# EasyEDA Pro project 4片ADS1299级联.epro, schematic Schematic1

## Sheets
1 P1: Board Name: Board1; Create Date: 2024-07-01; Page Name: P1; Project Name: 【开源】ADS1299-8通道脑机接口设备; Schematic Name: Schematic1; Update Date: 2024-11-04; BladeWidth: 10; Company: 嘉立创EDA; Page Size: A4; RegionStart: 1; ShowBorder: 1; TitleBlock: 1; TitleBlockPosition: 3; Version: V1.0; XRegionCount: 6; YRegionCount: 4
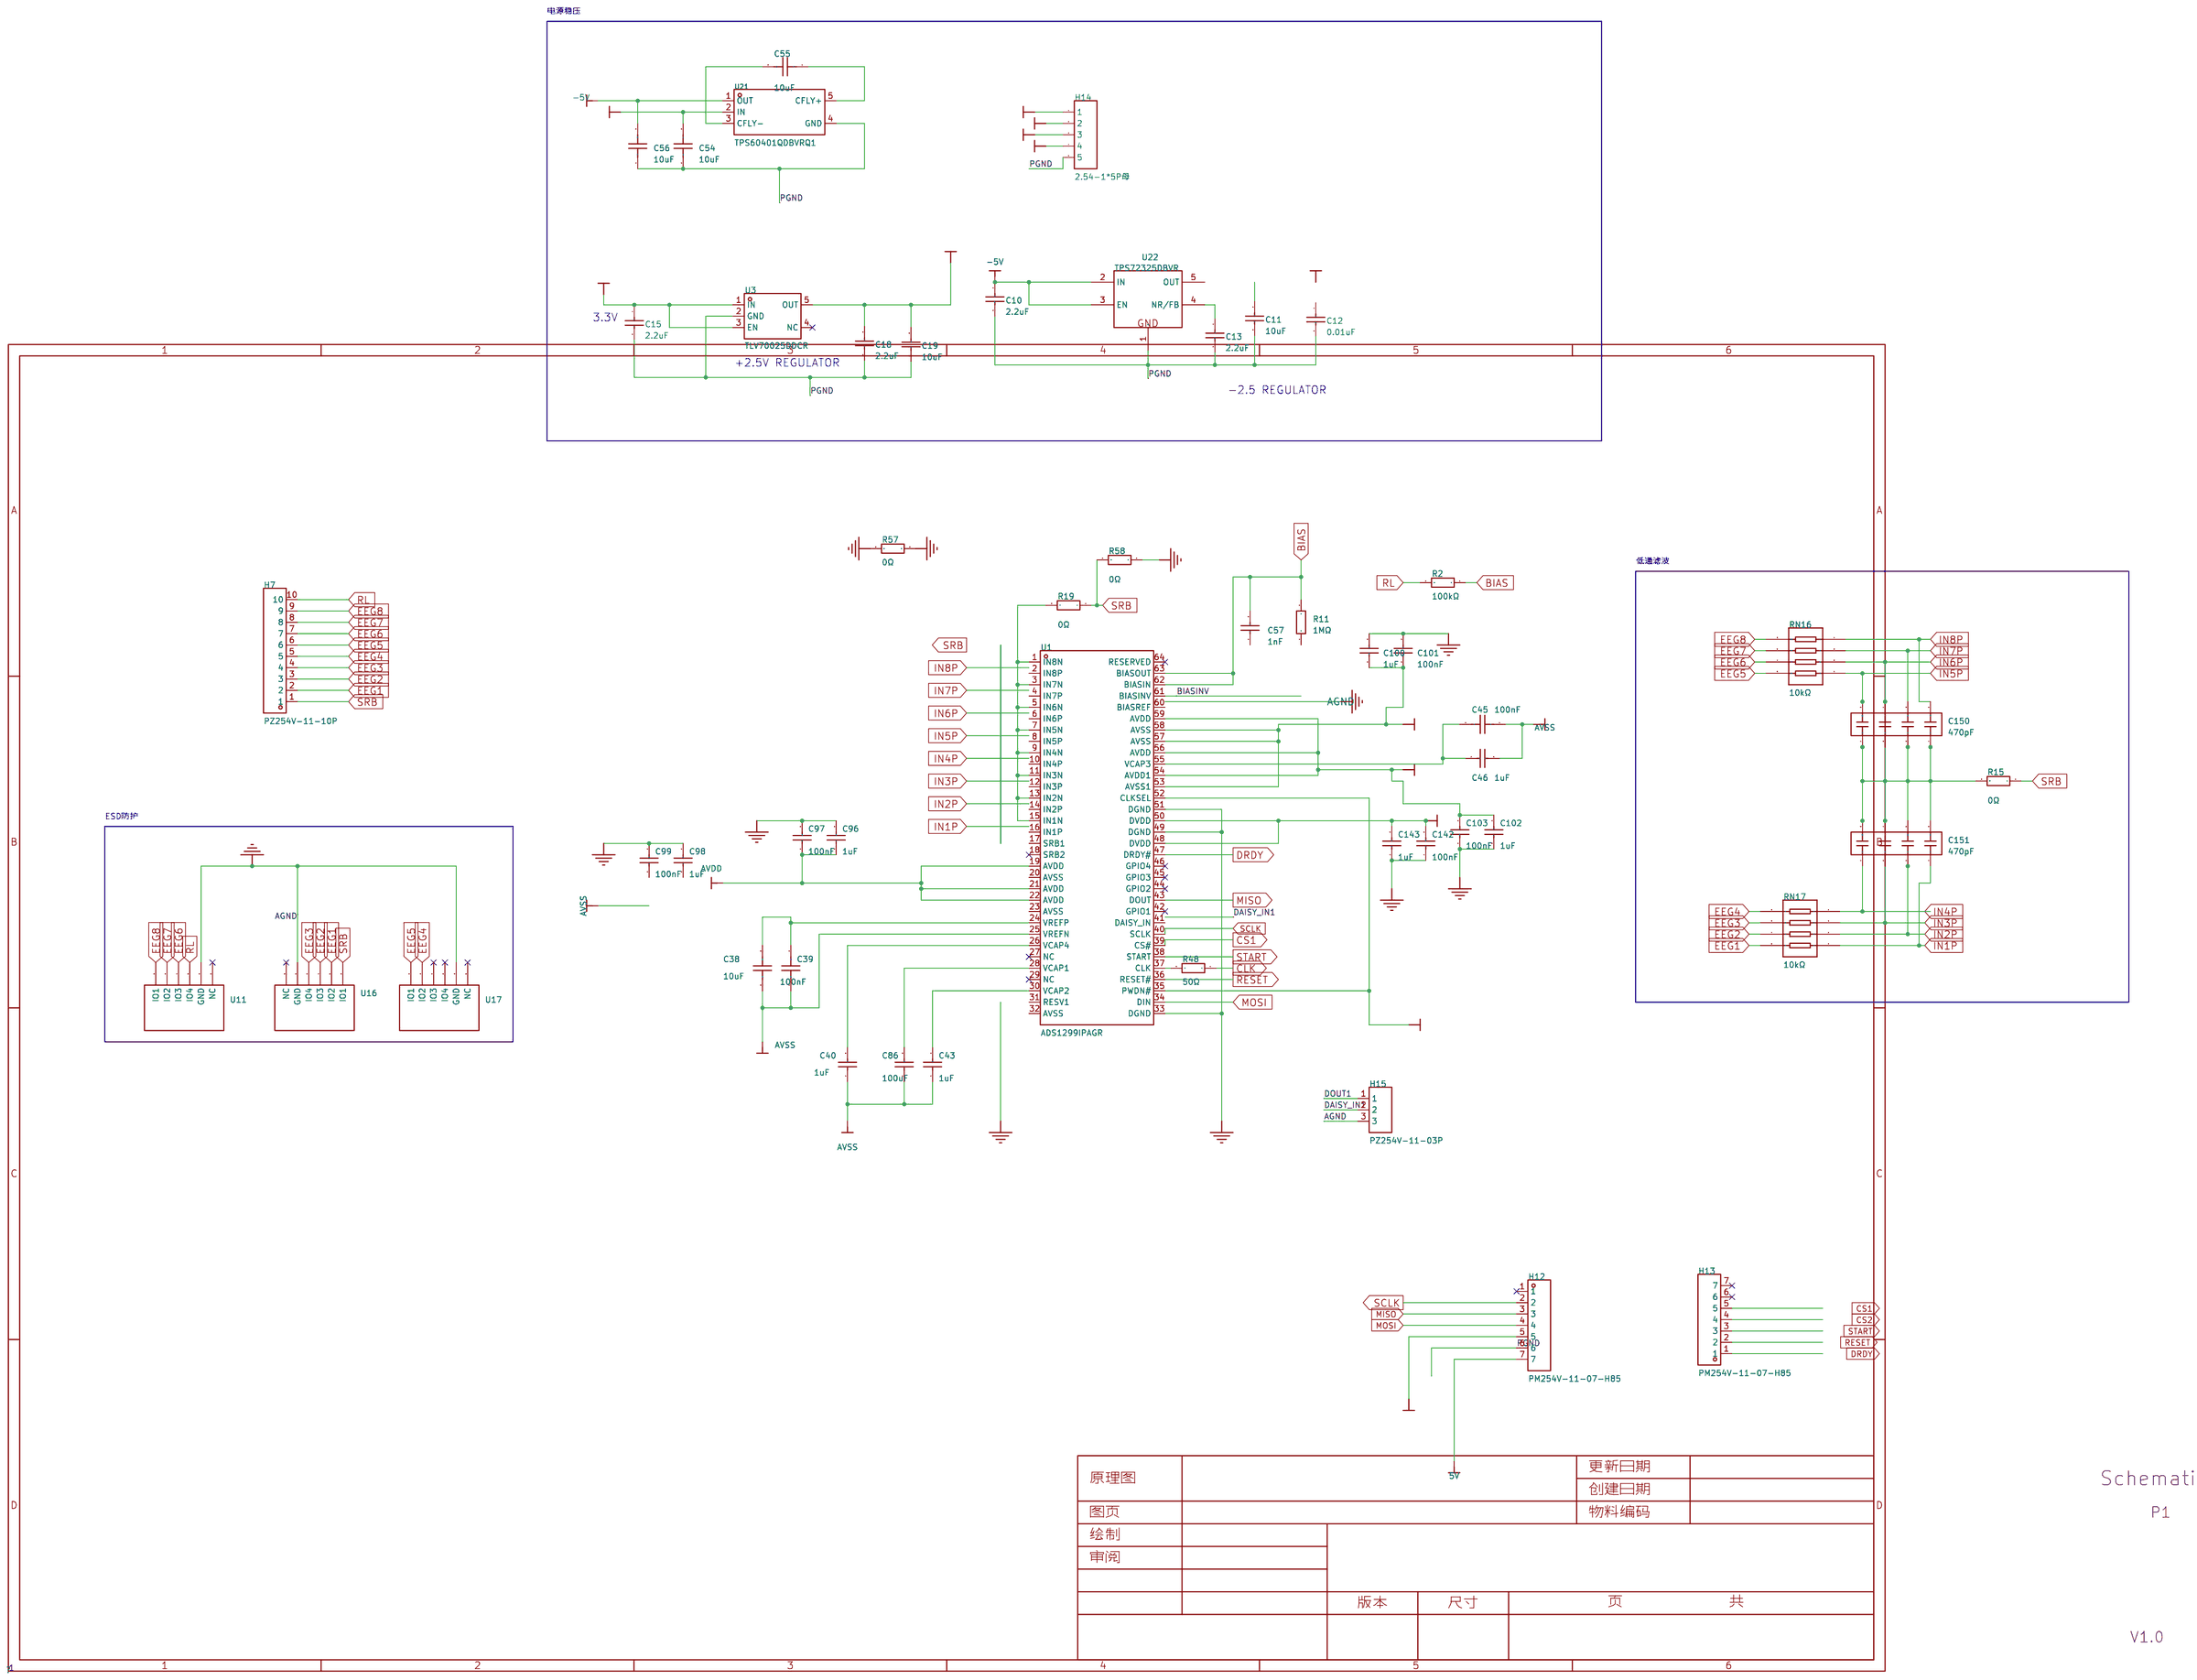
[diagram p0: P1]
2 P2: Create Date: 2026-03-20; Page Name: P3; Project Name: 【开源】ADS1299-8通道脑机接口设备_copy; Update Date: 2026-03-20
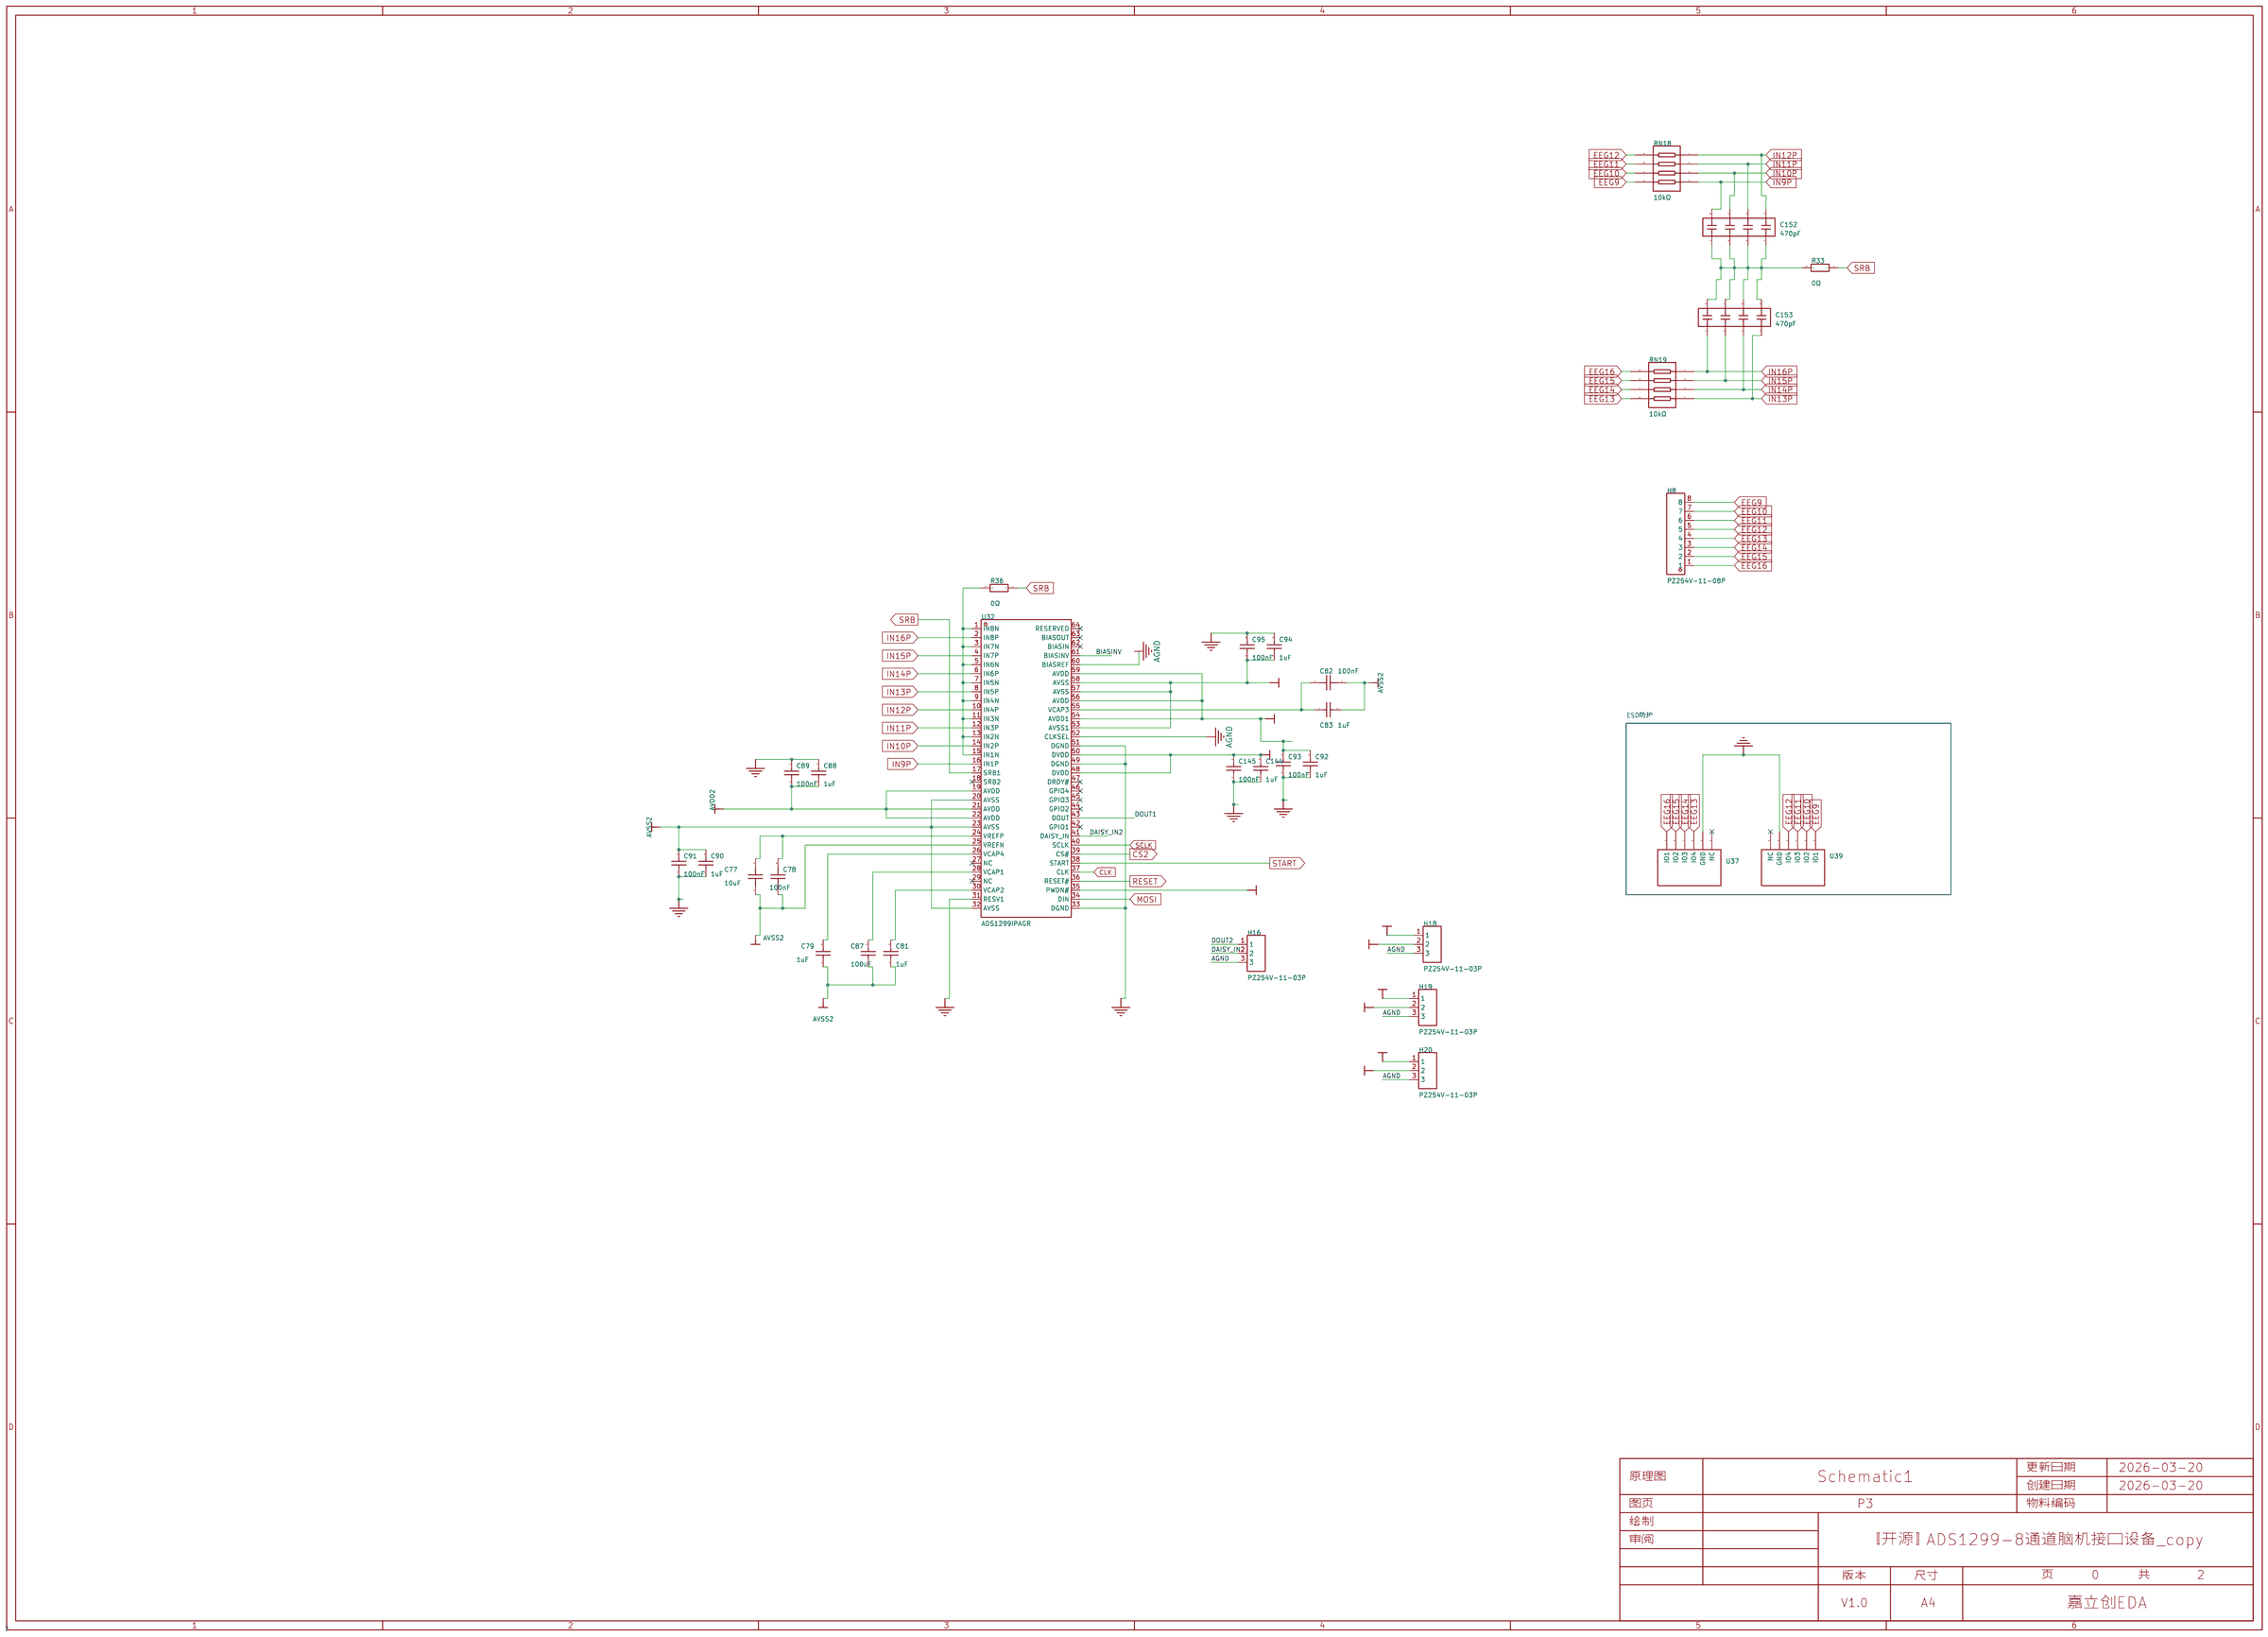
[diagram p1: P2]
3 P3: Create Date: 2026-03-25; Page Name: P3; Project Name: 16通道体表电位图仪_copy; Update Date: 2026-03-25
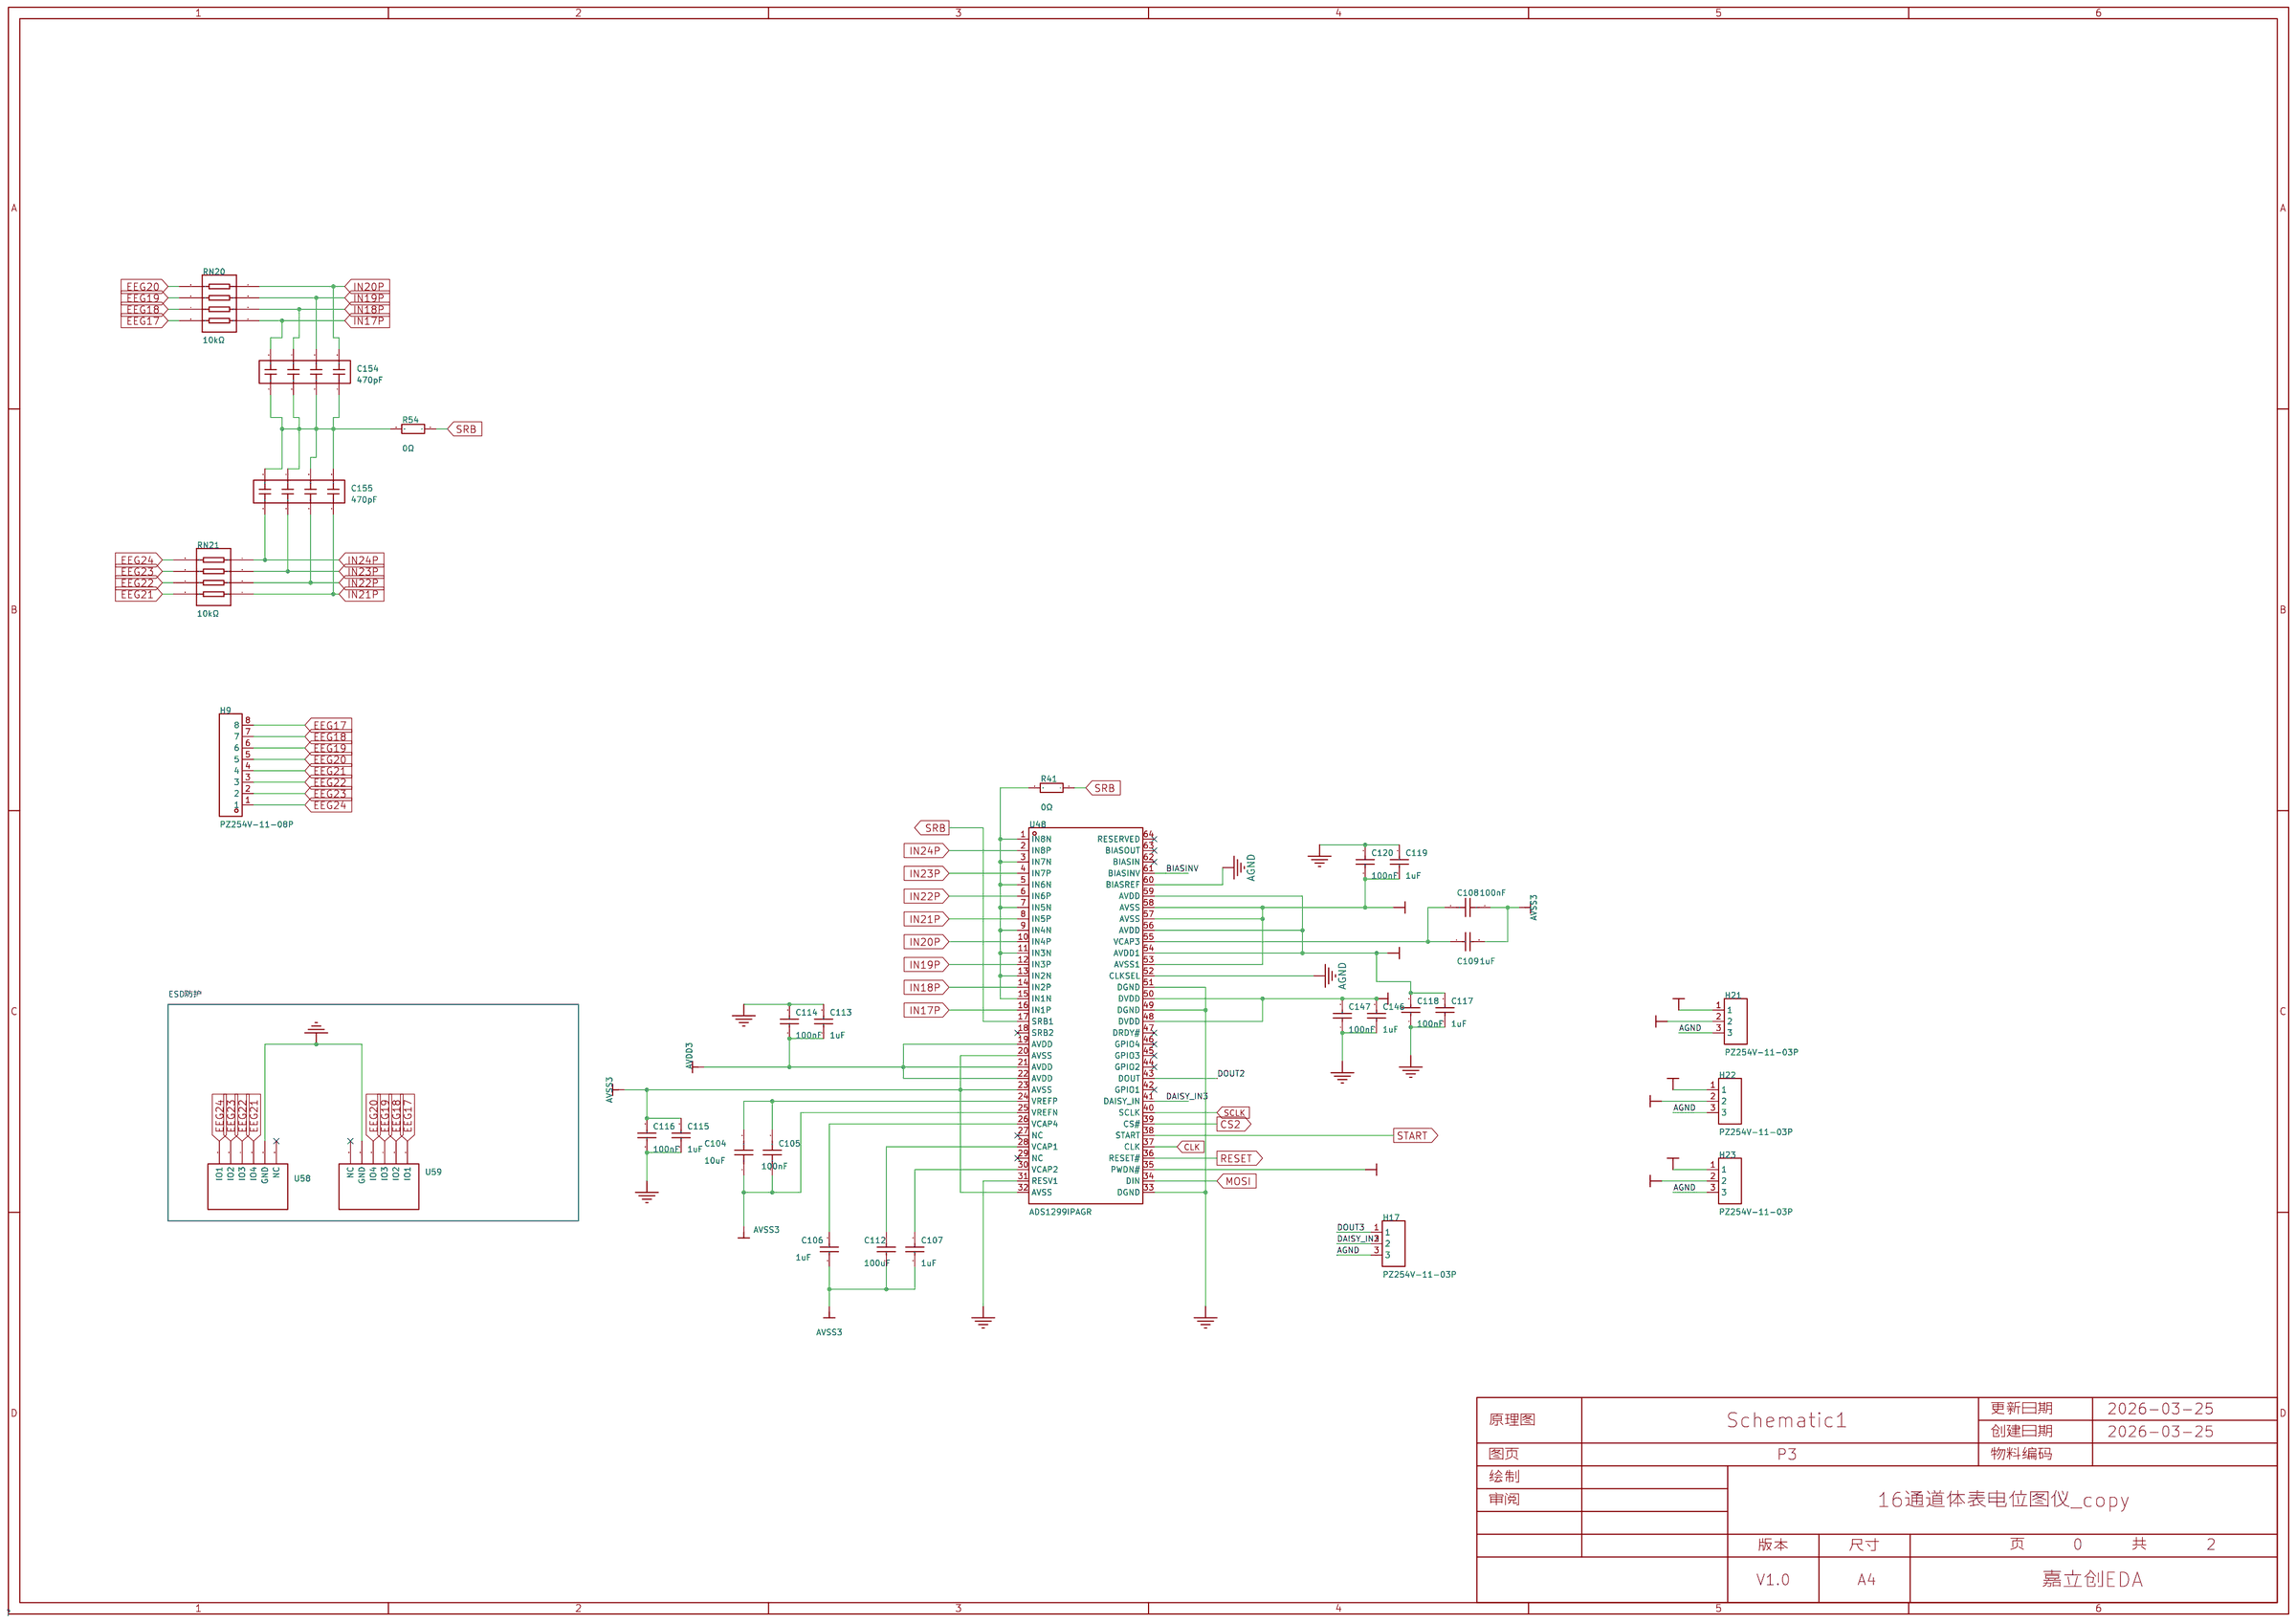
[diagram p2: P3]
4 P4: Create Date: 2026-04-07; Page Name: P4; Project Name: 16通道体表电位图仪_copy; Update Date: 2026-04-07
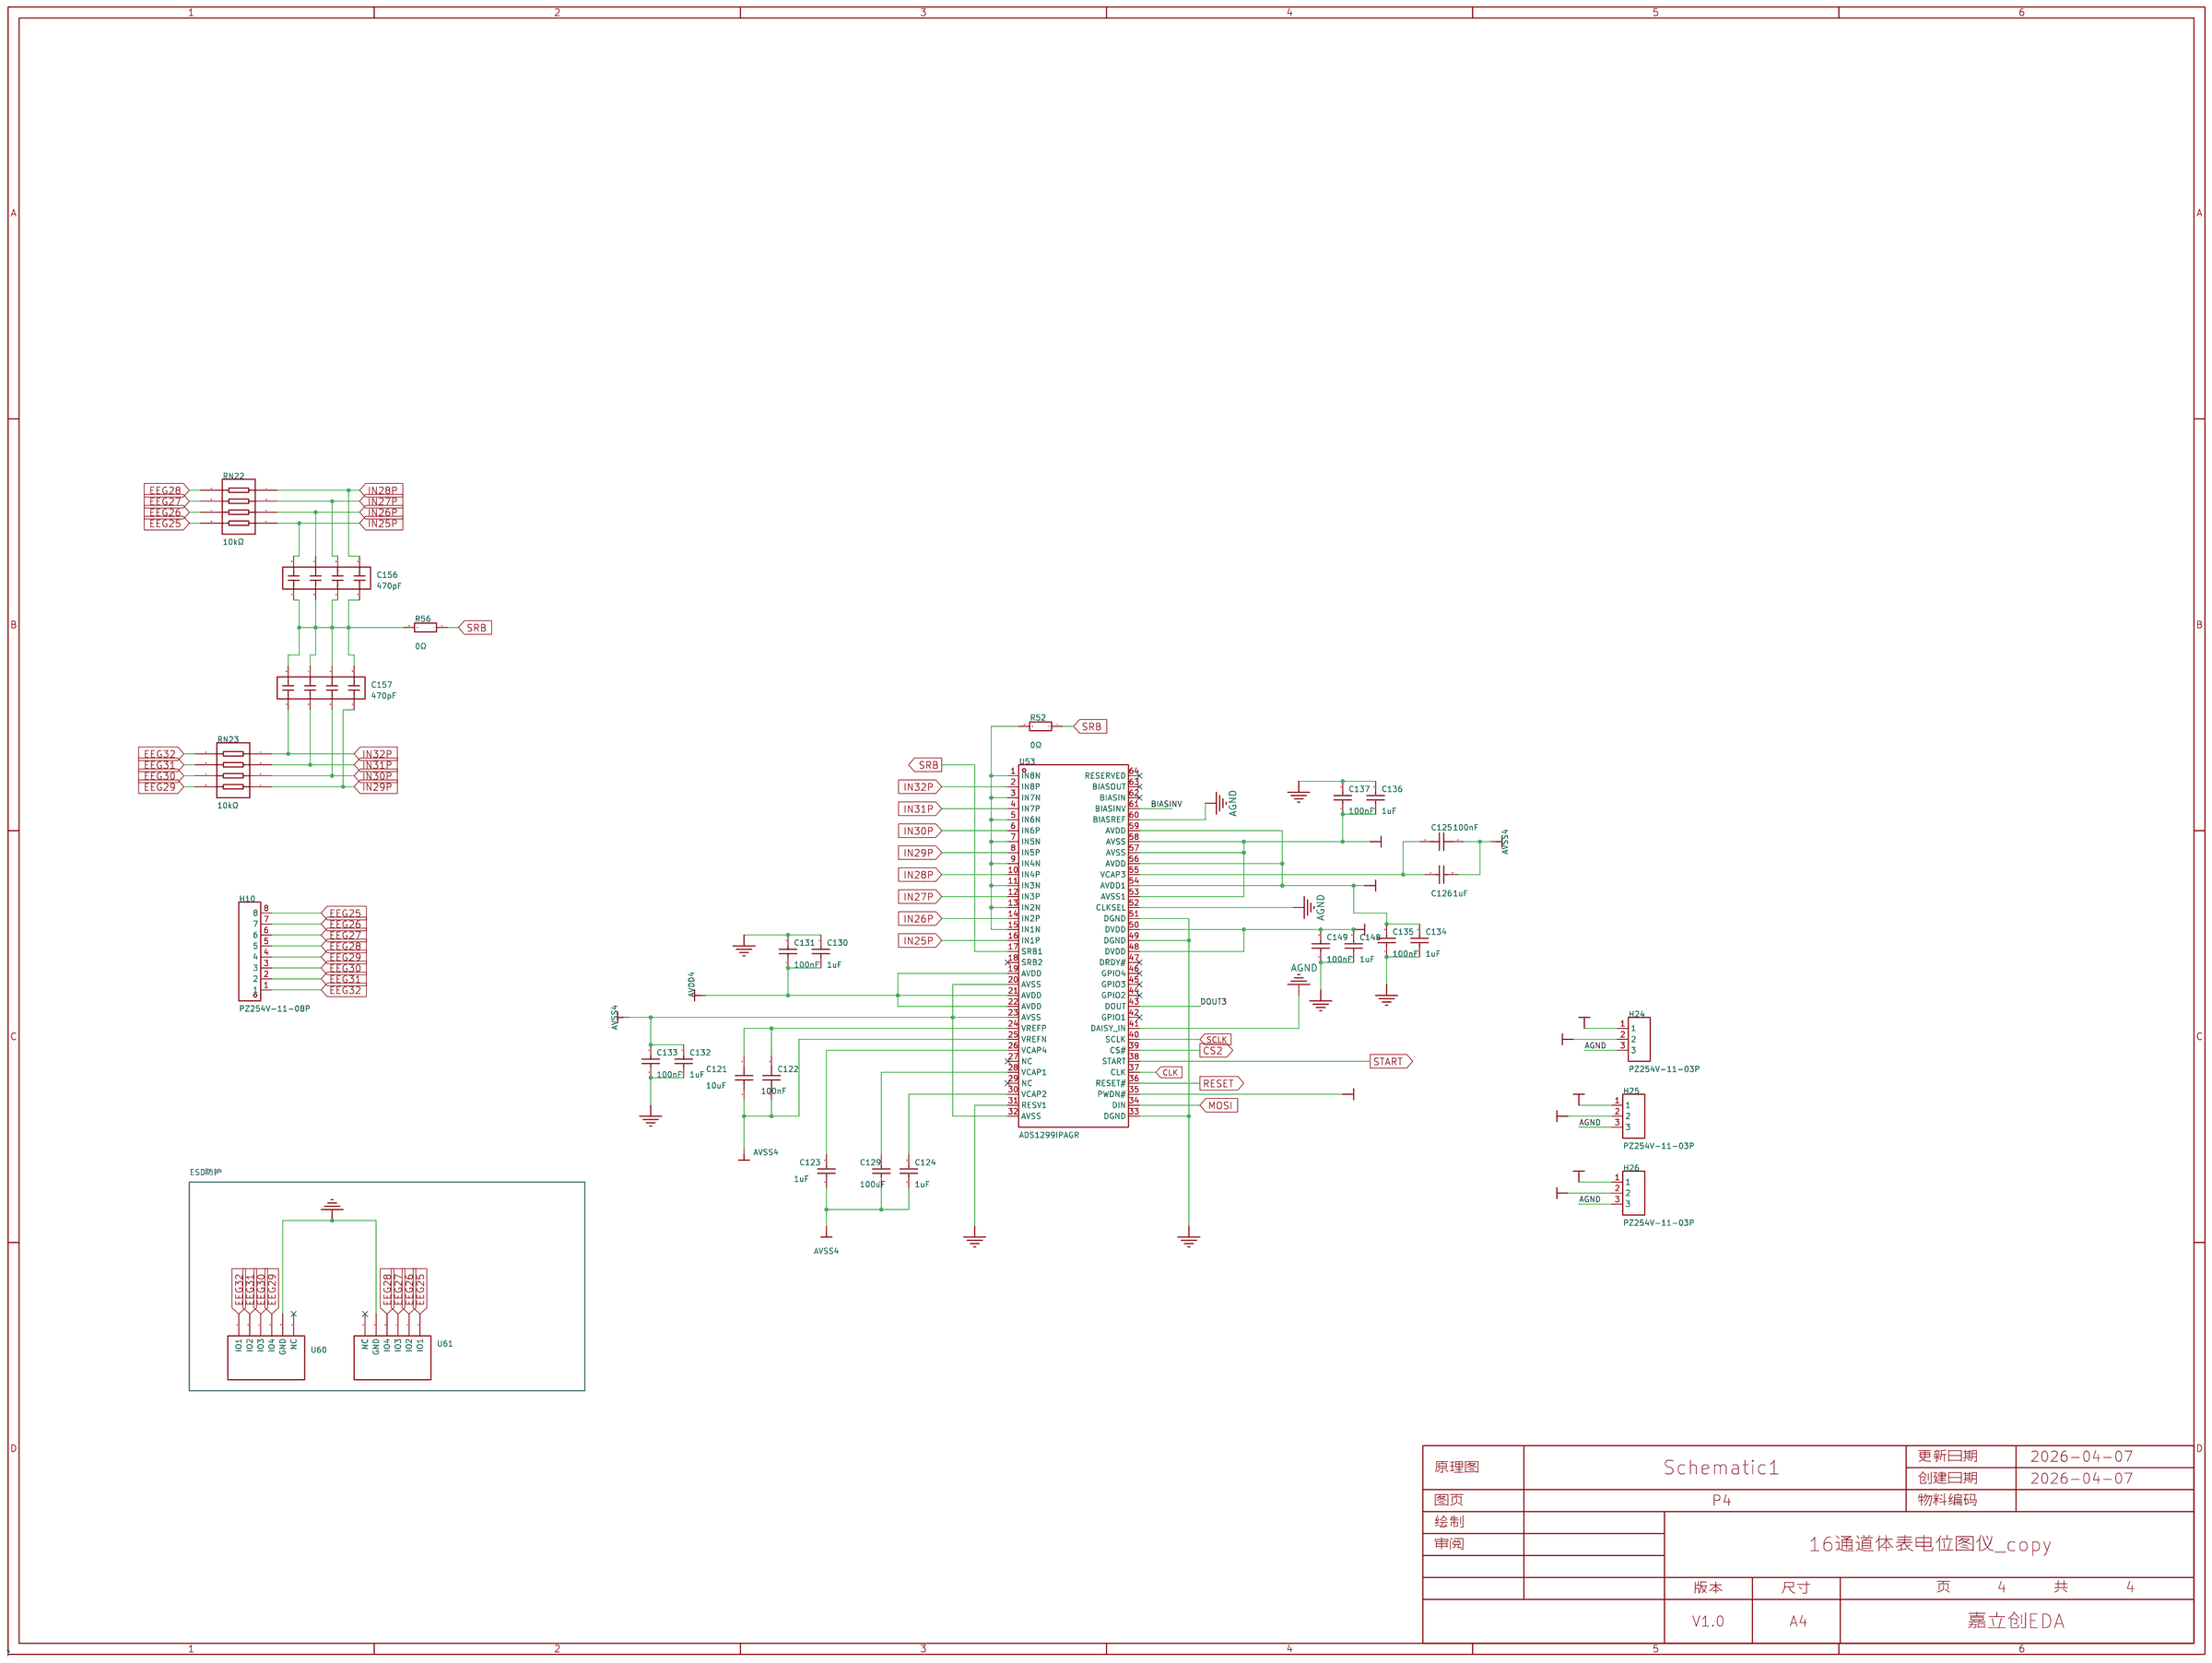
[diagram p3: P4]

## Parts
sheet P1
C10  2.2uF  [C0603]
C11  10uF  [C0603]
C12  0.01uF  [C0603]
C13  2.2uF  [C0603]
C15  2.2uF  [C0603]
C18  2.2uF  [C0603]
C19  10uF  [C0603]
C38  10uF  [C0603]
C39  100nF  [C0603]
C40  1uF  [C0603]
C43  1uF  [C0603]
C45  100nF  [C0603]
C46  1uF  [C0603]
C54  10uF  [C0603]
C55  10uF  [C0603]
C56  10uF  [C0603]
C57  1nF  [C0603]
C86  100uF  [C0603]
C96  1uF  [C0603]
C97  100nF  [C0603]
C98  1uF  [C0603]
C99  100nF  [C0603]
C100  1uF  [C0603]
C101  100nF  [C0603]
C102  1uF  [C0603]
C103  100nF  [C0603]
C142  100nF  [C0603]
C143  1uF  [C0603]
C150  470pF  [CAP-ARRAY-SMD_0612-8P-L3.2-W1.6-BL]
C151  470pF  [CAP-ARRAY-SMD_0612-8P-L3.2-W1.6-BL]
H7  PZ254V-11-10P  [HDR-TH_10P-P2.54-V-M]
H12  PM254V-11-07-H85  [HDR-TH_7P-P2.54-V-F]
H13  PM254V-11-07-H85  [HDR-TH_7P-P2.54-V-F]
H14  2.54-1*5P母  [HDR-TH_5P-P2.54-V-F]
H15  PZ254V-11-03P  [HDR-TH_3P-P2.54-V-M_PZ254V-11-03P]
R2  100kΩ  [C0603]
R11  1MΩ  [R0805]
R15  0Ω  [C0603]
R19  0Ω  [C0603]
R48  50Ω  [R0805]
R57  0Ω  [C0603]
R58  0Ω  [C0603]
RN16  10kΩ  [RES-ARRAY-SMD_0603-8P-L3.2-W1.6-BL]
RN17  10kΩ  [RES-ARRAY-SMD_0603-8P-L3.2-W1.6-BL]
U1  ADS1299IPAGR  [TQFP-64_L10.0-W10.0-P0.50-LS12.0-TL]
U3  TLV70025DDCR  [SOT-23-5_L3.0-W1.7-P0.95-LS2.8-BR]
U11  TPD4E1B06DCKR  [SC-70-6_L2.2-W1.3-P0.65-LS2.1-BL]
U16  TPD4E1B06DCKR  [SC-70-6_L2.2-W1.3-P0.65-LS2.1-BL]
U17  TPD4E1B06DCKR  [SC-70-6_L2.2-W1.3-P0.65-LS2.1-BL]
U21  TPS60401QDBVRQ1  [SOT-23-5_L2.9-W1.6-P0.95-LS2.8-BR]
U22  TPS72325DBVR  [SOT-23-5_L3.0-W1.7-P0.95-LS2.8-BR]
sheet P2
C77  10uF  [C0603]
C78  100nF  [C0603]
C79  1uF  [C0603]
C81  1uF  [C0603]
C82  100nF  [C0603]
C83  1uF  [C0603]
C87  100uF  [C0603]
C88  1uF  [C0603]
C89  100nF  [C0603]
C90  1uF  [C0603]
C91  100nF  [C0603]
C92  1uF  [C0603]
C93  100nF  [C0603]
C94  1uF  [C0603]
C95  100nF  [C0603]
C144  1uF  [C0603]
C145  100nF  [C0603]
C152  470pF  [CAP-ARRAY-SMD_0612-8P-L3.2-W1.6-BL]
C153  470pF  [CAP-ARRAY-SMD_0612-8P-L3.2-W1.6-BL]
H8  PZ254V-11-08P  [HDR-TH_8P-P2.54-V-M]
H16  PZ254V-11-03P  [HDR-TH_3P-P2.54-V-M_PZ254V-11-03P]
H18  PZ254V-11-03P  [HDR-TH_3P-P2.54-V-M_PZ254V-11-03P]
H19  PZ254V-11-03P  [HDR-TH_3P-P2.54-V-M_PZ254V-11-03P]
H20  PZ254V-11-03P  [HDR-TH_3P-P2.54-V-M_PZ254V-11-03P]
R33  0Ω  [C0603]
R36  0Ω  [C0603]
RN18  10kΩ  [RES-ARRAY-SMD_0603-8P-L3.2-W1.6-BL]
RN19  10kΩ  [RES-ARRAY-SMD_0603-8P-L3.2-W1.6-BL]
U32  ADS1299IPAGR  [TQFP-64_L10.0-W10.0-P0.50-LS12.0-TL]
U37  TPD4E1B06DCKR  [SC-70-6_L2.2-W1.3-P0.65-LS2.1-BL]
U39  TPD4E1B06DCKR  [SC-70-6_L2.2-W1.3-P0.65-LS2.1-BL]
sheet P3
C104  10uF  [C0603]
C105  100nF  [C0603]
C106  1uF  [C0603]
C107  1uF  [C0603]
C108  100nF  [C0603]
C109  1uF  [C0603]
C112  100uF  [C0603]
C113  1uF  [C0603]
C114  100nF  [C0603]
C115  1uF  [C0603]
C116  100nF  [C0603]
C117  1uF  [C0603]
C118  100nF  [C0603]
C119  1uF  [C0603]
C120  100nF  [C0603]
C146  1uF  [C0603]
C147  100nF  [C0603]
C154  470pF  [CAP-ARRAY-SMD_0612-8P-L3.2-W1.6-BL]
C155  470pF  [CAP-ARRAY-SMD_0612-8P-L3.2-W1.6-BL]
H9  PZ254V-11-08P  [HDR-TH_8P-P2.54-V-M]
H17  PZ254V-11-03P  [HDR-TH_3P-P2.54-V-M_PZ254V-11-03P]
H21  PZ254V-11-03P  [HDR-TH_3P-P2.54-V-M_PZ254V-11-03P]
H22  PZ254V-11-03P  [HDR-TH_3P-P2.54-V-M_PZ254V-11-03P]
H23  PZ254V-11-03P  [HDR-TH_3P-P2.54-V-M_PZ254V-11-03P]
R41  0Ω  [C0603]
R54  0Ω  [C0603]
RN20  10kΩ  [RES-ARRAY-SMD_0603-8P-L3.2-W1.6-BL]
RN21  10kΩ  [RES-ARRAY-SMD_0603-8P-L3.2-W1.6-BL]
U48  ADS1299IPAGR  [TQFP-64_L10.0-W10.0-P0.50-LS12.0-TL]
U58  TPD4E1B06DCKR  [SC-70-6_L2.2-W1.3-P0.65-LS2.1-BL]
U59  TPD4E1B06DCKR  [SC-70-6_L2.2-W1.3-P0.65-LS2.1-BL]
sheet P4
C121  10uF  [C0603]
C122  100nF  [C0603]
C123  1uF  [C0603]
C124  1uF  [C0603]
C125  100nF  [C0603]
C126  1uF  [C0603]
C129  100uF  [C0603]
C130  1uF  [C0603]
C131  100nF  [C0603]
C132  1uF  [C0603]
C133  100nF  [C0603]
C134  1uF  [C0603]
C135  100nF  [C0603]
C136  1uF  [C0603]
C137  100nF  [C0603]
C148  1uF  [C0603]
C149  100nF  [C0603]
C156  470pF  [CAP-ARRAY-SMD_0612-8P-L3.2-W1.6-BL]
C157  470pF  [CAP-ARRAY-SMD_0612-8P-L3.2-W1.6-BL]
H10  PZ254V-11-08P  [HDR-TH_8P-P2.54-V-M]
H24  PZ254V-11-03P  [HDR-TH_3P-P2.54-V-M_PZ254V-11-03P]
H25  PZ254V-11-03P  [HDR-TH_3P-P2.54-V-M_PZ254V-11-03P]
H26  PZ254V-11-03P  [HDR-TH_3P-P2.54-V-M_PZ254V-11-03P]
R52  0Ω  [C0603]
R56  0Ω  [C0603]
RN22  10kΩ  [RES-ARRAY-SMD_0603-8P-L3.2-W1.6-BL]
RN23  10kΩ  [RES-ARRAY-SMD_0603-8P-L3.2-W1.6-BL]
U53  ADS1299IPAGR  [TQFP-64_L10.0-W10.0-P0.50-LS12.0-TL]
U60  TPD4E1B06DCKR  [SC-70-6_L2.2-W1.3-P0.65-LS2.1-BL]
U61  TPD4E1B06DCKR  [SC-70-6_L2.2-W1.3-P0.65-LS2.1-BL]

## Library data of the parts
C10-C13 C15 C18 C19 = Cap: Capacitor; Published: 8-Jun-2000; LatestRevisionDate: 17-Jul-2002; LatestRevisionNote: Re-released for DXP Platform.; PackageReference: RAD-0.3; Publisher: Altium Limited; PackageDescription: Radial Cap, Thru-Hole; 2 Leads; 0.3 in Pin Spacing; Library Name: Miscellaneous Devices
C38 C54-C56 C77 C104 C121 = CL10A106MA8NRNC: 容值:10uF;精度:±20%;额定电压:25V;材质(温度系数):X5R;; LCSC Part Name: 10uF ±20% 25V; Supplier Part: C96446; Manufacturer: SAMSUNG(三星); Supplier Footprint: 0603; JLCPCB Part Class: Basic Part; Datasheet: https://atta.szlcsc.com/upload/public/pdf/source/20170325/1490427913016.pdf; Supplier: LCSC; Tolerance: ±20%; Voltage Rated: 25V; Temperature Coefficient: X5R
C39 C45 C78 C82 C105 C108 C122 C125 = GRM155R71H104KE14D: 容值:100nF;精度:±10%;额定电压:50V;材质(温度系数):X7R;; LCSC Part Name: 100nF ±10% 50V; Supplier Part: C77020; Manufacturer: muRata(村田); Supplier Footprint: 0402; JLCPCB Part Class: 扩展库; Datasheet: https://atta.szlcsc.com/upload/public/pdf/source/20180326/C77020_39BD49C951FF1AF0DB1F1FAC5AC1E401.pdf; Supplier: LCSC; Tolerance: ±10%; Voltage Rated: 50V; Temperature Coefficient: X7R
C40 C43 C79 C81 C86-C88 C90 C92 C94 C96 C98 C100 C102 C106 C107 C112 C113 C115 C117 C119 C123 C124 C129 C130 C132 C134 C136 C143 C144 C146 C148 = CL05A105KP5NNNC: 容值:1uF;精度:±10%;额定电压:10V;材质(温度系数):X5R;; LCSC Part Name: 1uF ±10% 10V; Supplier Part: C14445; Manufacturer: SAMSUNG(三星); Supplier Footprint: 0402; JLCPCB Part Class: Extended Part; Datasheet: https://atta.szlcsc.com/upload/public/pdf/source/20160103/1457707670698.pdf; Supplier: LCSC; Tolerance: ±10%; Voltage Rated: 10V; Temperature Coefficient: X5R; Design Item ID: 100nF
C46 C83 C89 C91 C93 C95 C97 C99 C101 C103 C109 C114 C116 C118 C120 C126 C131 C133 C135 C137 C142 C145 C147 C149 = CL05A105KP5NNNC: 容值:1uF;精度:±10%;额定电压:10V;材质(温度系数):X5R;; LCSC Part Name: 1uF ±10% 10V; Supplier Part: C14445; Manufacturer: SAMSUNG(三星); Supplier Footprint: 0402; JLCPCB Part Class: Extended Part; Datasheet: https://atta.szlcsc.com/upload/public/pdf/source/20160103/1457707670698.pdf; Supplier: LCSC; Tolerance: ±10%; Voltage Rated: 10V; Temperature Coefficient: X5R
C57 = CC0402KRX7R9BB102: 容值:1nF;精度:±10%;额定电压:50V;材质(温度系数):X7R;; LCSC Part Name: 1nF ±10% 50V; Supplier Part: C106205; Manufacturer: YAGEO(国巨); Supplier Footprint: 0402; JLCPCB Part Class: 扩展库; Datasheet: https://atta.szlcsc.com/upload/public/pdf/source/20181008/C309510_22F155564471FAF6A489F7D68F34234E.pdf; Supplier: LCSC; Tolerance: ±10%; Voltage Rated: 50V; Temperature Coefficient: X7R
C150-C157 = CA0612KRX7R9BB471: 容值:470pF;精度:±10%;额定电压:50V;温度系数:X7R;电路形式:独立;; LCSC Part Name: 470pFX4 ±10% 50V; Supplier Part: C576643; Manufacturer: YAGEO(国巨); Supplier Footprint: 0603x4; JLCPCB Part Class: Extended Part; Datasheet: https://item.szlcsc.com/datasheet/CA0612KRX7R9BB471/604134.html; Supplier: LCSC; Tolerance: ±10%; Voltage Rating: 50V; Temperature Coefficient: X7R; Number of Capacitors: 4; Circuit Type: 独立
H7 = PZ254V-11-10P: 插针结构:1x10P;间距:2.54mm;行距:-;圆针/方针:方针;安装类型:直插;排数:单排;总PIN位数:10P;额定电流:-;额定电压:-;配合针长度:6mm;塑高:2.5mm;端接针长度:3mm;触头材质:黄铜;触头镀层:-;工作温度范围:-40℃~+105℃;颜色:黑色;; LCSC Part Name: 间距:2.54mm 1x10P 直插 方针; Supplier Part: C492409; Manufacturer: XFCN(兴飞); Supplier Footprint: 插件,P=2.54mm; JLCPCB Part Class: 扩展库; Datasheet: https://atta.szlcsc.com/upload/public/pdf/source/20200309/C492409_129C9431BDD62EBBBD0A643B6AAB9FBD.pdf; Supplier: LCSC; Pin Structure: 1x10P; Pitch: 2.54mm; Circluar Pins/Square Pins: 方针; Mounting Type: 直插; Number of Rows: 单排; Number of Pins: 10P; Length of Mating Pin: 6mm; Insulation Height: 2.5mm; Length of End Connection Pin: 3mm; Contact Material: 黄铜; Operating Temperature Range: -40℃~+105℃; Color: 黑色
H12 H13 = PM254V-11-07-H85: 插孔结构:1x7P;间距:2.54mm;行距:-;圆孔/方孔:方孔;安装方式:直插;排数:单排;总孔位数:7P;额定电流:3A;额定电压:250V;插孔方向:顶部;塑高:-;工作温度:-40℃~+105℃;; LCSC Part Name: 间距:2.54mm 1x7P 直插; Supplier Part: C2832270; Manufacturer: XFCN(兴飞); Supplier Footprint: 插件,P=2.54mm; JLCPCB Part Class: Extended Part; Datasheet: https://item.szlcsc.com/datasheet/PM254V-11-07-H85/2989788.html; Supplier: LCSC; Holes Structure: 1x7P; Pitch: 2.54mm; Circular Hole / Square Hole: 方孔; Mounting Type: 直插; Number of Rows: 单排; Number of Positions: 7P; Current Rating: 3A; Voltage Rating (Max): 250V; Holes Direction: 顶部; Operating Temperature: -40℃~+105℃
H14 = 2.54-1*5P母: 插孔结构:1x5P;间距:2.54mm;行距:-;圆孔/方孔:方孔;安装方式:直插;排数:单排;总孔位数:5P;额定电流:3A;插孔方向:顶部;塑高:8.5mm;触头材质:黄铜;触头镀层:金;工作温度:-55℃~+105℃;; LCSC Part Name: 1x5P 间距:2.54mm 直插; Supplier Part: C50950; Manufacturer: BOOMELE(博穆精密); Supplier Footprint: 插件,P=2.54mm; JLCPCB Part Class: Extended Part; Datasheet: https://item.szlcsc.com/datasheet/2.54-1*5P%25E6%25AF%258D/51962.html; Supplier: LCSC; Holes Structure: 1x5P; Pitch: 2.54mm; Circular Hole / Square Hole: 方孔; Mounting Type: 直插; Number of Rows: 单排; Number of Positions: 5P; Current Rating: 3A; Holes Direction: 顶部; Insulation Height: 8.5mm; Contact Material: 黄铜; Contact Plating: 金; Operating Temperature: -55℃~+105℃; PIN Length: 3.2mm
H15-H26 = PZ254V-11-03P: 插针结构:1x3P;间距:2.54mm;行距:-;圆针/方针:方针;安装方式:直插;排数:单排;总PIN位数:3P;额定电流:3A;额定电压:250V;配合针长度:6mm;塑高:2.5mm;端接针长度:3mm;工作温度:-40℃~+105℃;颜色:黑色;; LCSC Part Name: 1x3P 间距:2.54mm 方针 直插; Supplier Part: C2937625; Manufacturer: XFCN(兴飞); Supplier Footprint: 插件,P=2.54mm; JLCPCB Part Class: Extended Part; Datasheet: https://item.szlcsc.com/datasheet/PZ254V-11-03P/3293280.html; Supplier: LCSC; Pin Structure: 1x3P; Pitch: 2.54mm; Circluar Pins/Square Pins: 方针; Mounting Type: 直插; Number of Rows: 单排; Number of Pins: 3P; Current Rating: 3A; Voltage Rating (Max): 250V; Length of Mating Pin: 6mm; Insulation Height: 2.5mm; Length of End Connection Pin: 3mm; Operating Temperature: -40℃~+105℃; Color: 黑色
R2 = RC0402FR-07100KL: 电阻类型:厚膜电阻;阻值:100kΩ;精度:±1%;功率:62.5mW;最大工作电压:50V;温度系数:±100ppm/℃;; LCSC Part Name: 厚膜电阻 100kΩ ±1% 62.5mW; Supplier Part: C60491; Manufacturer: YAGEO(国巨); Supplier Footprint: 0402; JLCPCB Part Class: 扩展库; Datasheet: https://atta.szlcsc.com/upload/public/pdf/source/20180927/C295883_E8D83085EA81BD7DE0B2B681138C15EE.pdf; Supplier: LCSC; Type: 厚膜电阻; Tolerance: ±1%; Power(Watts): 62.5mW; Overload Voltage (Max): 50V; Temperature Coefficient: ±100ppm/℃; Operating Temperature Range: -55℃~+155℃
R11 R48 = 0805W8F1004T5E: 电阻类型:厚膜电阻;阻值:1MΩ;精度:±1%;功率:125mW;最大工作电压:150V;温度系数:±100ppm/℃;; LCSC Part Name: 1MΩ ±1% 125mW 厚膜电阻; Supplier Part: C17514; Manufacturer: UNI-ROYAL(厚声); Supplier Footprint: 0805; JLCPCB Part Class: 基础库; Datasheet: https://atta.szlcsc.com/upload/public/pdf/source/20200306/C422600_1E6D84923E4A46A82E41ADD87F860B5C.pdf; Supplier: LCSC; Type: 厚膜电阻; Tolerance: ±1%; Power(Watts): 125mW; Overload Voltage (Max): 150V; Temperature Coefficient: ±100ppm/℃; Operating Temperature Range: -55℃~+155℃
R15 R19 R33 R36 R41 R52 R54 R56-R58 = 0402WGF0000TCE: 电阻类型:厚膜电阻;阻值:0Ω;精度:±1%;功率:62.5mW;最大工作电压:50V;温度系数:±800ppm/℃;; LCSC Part Name: 0Ω ±1% 62.5mW 厚膜电阻; Supplier Part: C17168; Manufacturer: UNI-ROYAL(厚声); Supplier Footprint: 0402; JLCPCB Part Class: 基础库; Datasheet: https://atta.szlcsc.com/upload/public/pdf/source/20200306/C422600_1E6D84923E4A46A82E41ADD87F860B5C.pdf; Supplier: LCSC; Type: 厚膜电阻; Tolerance: ±1%; Power(Watts): 62.5mW; Overload Voltage (Max): 50V; Temperature Coefficient: ±800ppm/℃; Operating Temperature Range: -55℃~+155℃
RN16-RN23 = YC164-FR-0710KL: 电阻器数:4;阻值:10kΩ;精度:±1%;单个元件功率:62.5mW;温度系数:±200ppm/℃;; LCSC Part Name: 10kΩ ±1% 0603x4; Supplier Part: C110924; Manufacturer: YAGEO(国巨); Supplier Footprint: 0603x4; JLCPCB Part Class: Extended Part; Datasheet: https://atta.szlcsc.com/upload/public/pdf/source/20170912/C110924_1505207735334963352.pdf; Supplier: LCSC; Number of Resistors: 4; Tolerance: ±1%; Power(Watts): 62.5mW; Temperature Coefficient: ±200ppm/℃; Number of Pins: 8
U1 U32 U48 U53 = ADS1299IPAGR: 电源电压:5V；1.8V~3.6V;; Supplier Part: C476817; Manufacturer: TI(德州仪器); Supplier Footprint: TQFP-64(10x10); JLCPCB Part Class: 扩展库; Datasheet: https://www.ti.com/cn/lit/gpn/ads1299; Supplier: LCSC; Supply Voltage: 5V；1.8V~3.6V
U3 = TLV70025DDCR: Library Name: openbci
U11 U16 U17 U37 U39 U58-U61 = TPD4E1B06DCKR: Library Name: Schlib1
U21 = TPS60401QDBVRQ1: 功能类型:-;输出类型:固定;输入电压:1.8V~5.25V;输出电流(最大值):60mA;; Supplier Part: C2071133; Manufacturer: TI(德州仪器); Supplier Footprint: SOT-23-5; JLCPCB Part Class: 扩展库; Datasheet: https://www.ti.com/cn/lit/gpn/tps60401-q1; Supplier: LCSC; Output Type: 固定; Input Voltage: 1.8V~5.25V; Output Current (Max): 60mA; Switching Frequency: 20kHz; Operating Temperature: -40℃~+125℃@(TJ); Synchronous Rectification: 否; Number of Outputs: 1; Switch tube (built-in/external): 内置
U22 = TPS72325DBVR: 输出类型:固定;输出极性:负;最大输入电压:10V;输出电压:2.5V;输出电流:200mA;电源纹波抑制比(PSRR):65dB;; Supplier Part: C69932; Manufacturer: TI(德州仪器); Supplier Footprint: SOT-23-5; JLCPCB Part Class: Extended Part; Datasheet: https://atta.szlcsc.com/upload/public/pdf/source/20171113/C69932_15105675558771116637.pdf; Supplier: LCSC; Output Type: 固定; Output Polarity: 负; Number of Outputs: 1; Maximum Input Voltage: 10V; Output Voltage: 2.5V; Dropout Voltage: 500mV@(200mA); Output Current: 200mA; Power Supply Rejection Ratio (PSRR): 65dB; Origin Footprint 1: SOT23-5L
H8-H10 = PZ254V-11-08P: 插针结构:1x8P;间距:2.54mm;行距:-;圆针/方针:方针;安装类型:直插;排数:单排;总PIN位数:8P;额定电流:-;额定电压:-;配合针长度:6mm;塑高:2.5mm;端接针长度:3mm;触头材质:黄铜;触头镀层:-;工作温度范围:-40℃~+105℃;颜色:黑色;; LCSC Part Name: 间距:2.54mm 1x8P 直插 方针; Supplier Part: C492407; Manufacturer: XFCN(兴飞); Supplier Footprint: 插件,P=2.54mm; JLCPCB Part Class: 扩展库; Datasheet: https://atta.szlcsc.com/upload/public/pdf/source/20200309/C492407_83A6FB26A2233368EDB9516968EC6149.pdf; Supplier: LCSC; Pin Structure: 1x8P; Pitch: 2.54mm; Circluar Pins/Square Pins: 方针; Mounting Type: 直插; Number of Rows: 单排; Number of Pins: 8P; Length of Mating Pin: 6mm; Insulation Height: 2.5mm; Length of End Connection Pin: 3mm; Contact Material: 黄铜; Operating Temperature Range: -40℃~+105℃; Color: 黑色

## Nets
5V: C54.2 H12.7 H14.4 U21.2(IN)
-5V: C10.1 C56.2 U21.1(OUT) U22.2(IN) U22.3(EN)
AGND: C88.2 C89.2 C90.1 C91.1 C92.1 C93.1 C94.2 C95.2 C96.2 C97.2 C98.2 C99.2 C100.2 C101.2 C102.1 C103.1 C113.2 C114.2 C115.1 C116.1 C117.1 C118.1 C119.2 C120.2 C130.2 C131.2 C132.1 C133.1 C134.1 C135.1 C136.2 C137.2 C142.1 C143.1 C144.1 C145.1 C146.1 C147.1 C148.1 C149.1 H15.3 H16.3 H17.3 H18.3 H19.3 H20.3 H21.3 H22.3 H23.3 H24.3 H25.3 H26.3 R57.1 R58.1 U1.31(RESV1) U1.33(DGND) U1.49(DGND) U1.51(DGND) U1.60(BIASREF) U11.3(GND) U16.3(GND) U17.3(GND) U32.31(RESV1) U32.33(DGND) U32.49(DGND) U32.51(DGND) U32.52(CLKSEL) U32.60(BIASREF) U37.3(GND) U39.3(GND) U48.31(RESV1) U48.33(DGND) U48.49(DGND) U48.51(DGND) U48.52(CLKSEL) U48.60(BIASREF) U53.31(RESV1) U53.33(DGND) U53.41(DAISY_IN) U53.49(DGND) U53.51(DGND) U53.52(CLKSEL) U53.60(BIASREF) U58.3(GND) U59.3(GND) U60.3(GND) U61.3(GND)
AVDD: C18.1 C19.1 C96.1 C97.1 C102.2 C103.2 H14.2 H18.1 H21.1 H24.1 U1.19(AVDD) U1.21(AVDD) U1.22(AVDD) U1.54(AVDD1) U1.56(AVDD) U1.59(AVDD) U3.5(OUT)
AVDD2: C88.1 C89.1 C92.2 C93.2 H18.2 U32.19(AVDD) U32.21(AVDD) U32.22(AVDD) U32.54(AVDD1) U32.56(AVDD) U32.59(AVDD)
AVDD3: C113.1 C114.1 C117.2 C118.2 H21.2 U48.19(AVDD) U48.21(AVDD) U48.22(AVDD) U48.54(AVDD1) U48.56(AVDD) U48.59(AVDD)
AVDD4: C130.1 C131.1 C134.2 C135.2 H24.2 U53.19(AVDD) U53.21(AVDD) U53.22(AVDD) U53.54(AVDD1) U53.56(AVDD) U53.59(AVDD)
AVSS: C11.1 C12.1 C38.1 C39.1 C40.1 C43.1 C45.1 C46.2 C86.1 C98.1 C99.1 C100.1 C101.1 H14.1 H20.1 H23.1 H26.1 U1.20(AVSS) U1.23(AVSS) U1.25(VREFN) U1.32(AVSS) U1.53(AVSS1) U1.57(AVSS) U1.58(AVSS) U22.5(OUT)
AVSS2: C77.1 C78.1 C79.1 C81.1 C82.1 C83.2 C87.1 C90.2 C91.2 C94.1 C95.1 H20.2 U32.20(AVSS) U32.23(AVSS) U32.25(VREFN) U32.32(AVSS) U32.53(AVSS1) U32.57(AVSS) U32.58(AVSS)
AVSS3: C104.1 C105.1 C106.1 C107.1 C108.1 C109.2 C112.1 C115.2 C116.2 C119.1 C120.1 H23.2 U48.20(AVSS) U48.23(AVSS) U48.25(VREFN) U48.32(AVSS) U48.53(AVSS1) U48.57(AVSS) U48.58(AVSS)
AVSS4: C121.1 C122.1 C123.1 C124.1 C125.1 C126.2 C129.1 C132.2 C133.2 C136.1 C137.1 H26.2 U53.20(AVSS) U53.23(AVSS) U53.25(VREFN) U53.32(AVSS) U53.53(AVSS1) U53.57(AVSS) U53.58(AVSS)
DVDD: C15.1 C142.2 C143.2 H12.5 H14.3 H19.1 H22.1 H25.1 U1.35(PWDN#) U1.48(DVDD) U1.50(DVDD) U1.52(CLKSEL) U3.1(IN) U3.3(EN)
DVDD2: C144.2 C145.2 H19.2 U32.35(PWDN#) U32.48(DVDD) U32.50(DVDD)
DVDD3: C146.2 C147.2 H22.2 U48.35(PWDN#) U48.48(DVDD) U48.50(DVDD)
DVDD4: C148.2 C149.2 H25.2 U53.35(PWDN#) U53.48(DVDD) U53.50(DVDD)
PGND: C10.2 C11.2 C12.2 C13.2 C15.2 C18.2 C19.2 C54.1 C56.1 H12.6 H14.5 R57.2 U3.2(GND) U21.4(GND) U22.1(GND)
BIAS: C57.2 R2.1 R11.2 U1.62(BIASIN) U1.63(BIASOUT)
BIASINV: C57.1 R11.1 U1.61(BIASINV) U32.61(BIASINV) U48.61(BIASINV) U53.61(BIASINV)
CLK: R48.1 U32.37(CLK) U48.37(CLK) U53.37(CLK)
CS1: H13.5 U1.39(CS#)
CS2: H13.4 U32.39(CS#) U48.39(CS#) U53.39(CS#)
DAISY_IN1: H15.2 U1.41(DAISY_IN)
DAISY_IN2: H16.2 U32.41(DAISY_IN)
DAISY_IN3: H17.2 U48.41(DAISY_IN)
DOUT1: H15.1 U32.43(DOUT)
DOUT2: H16.1 U48.43(DOUT)
DOUT3: H17.1 U53.43(DOUT)
DRDY: H13.1 U1.47(DRDY#)
EEG1: H7.2 RN17.8 U16.2(IO2)
EEG2: H7.3 RN17.7 U16.4(IO3)
EEG3: H7.4 RN17.6 U16.5(IO4)
EEG4: H7.5 RN17.5 U17.2(IO2)
EEG5: H7.6 RN16.8 U17.1(IO1)
EEG6: H7.7 RN16.7 U11.4(IO3)
EEG7: H7.8 RN16.6 U11.2(IO2)
EEG8: H7.9 RN16.5 U11.1(IO1)
EEG9: H8.8 RN18.8 U39.1(IO1)
EEG10: H8.7 RN18.7 U39.2(IO2)
EEG11: H8.6 RN18.6 U39.4(IO3)
EEG12: H8.5 RN18.5 U39.5(IO4)
EEG13: H8.4 RN19.8 U37.5(IO4)
EEG14: H8.3 RN19.7 U37.4(IO3)
EEG15: H8.2 RN19.6 U37.2(IO2)
EEG16: H8.1 RN19.5 U37.1(IO1)
EEG17: H9.8 RN20.8 U59.1(IO1)
EEG18: H9.7 RN20.7 U59.2(IO2)
EEG19: H9.6 RN20.6 U59.4(IO3)
EEG20: H9.5 RN20.5 U59.5(IO4)
EEG21: H9.4 RN21.8 U58.5(IO4)
EEG22: H9.3 RN21.7 U58.4(IO3)
EEG23: H9.2 RN21.6 U58.2(IO2)
EEG24: H9.1 RN21.5 U58.1(IO1)
EEG25: H10.8 RN22.8 U61.1(IO1)
EEG26: H10.7 RN22.7 U61.2(IO2)
EEG27: H10.6 RN22.6 U61.4(IO3)
EEG28: H10.5 RN22.5 U61.5(IO4)
EEG29: H10.4 RN23.8 U60.5(IO4)
EEG30: H10.3 RN23.7 U60.4(IO3)
EEG31: H10.2 RN23.6 U60.2(IO2)
EEG32: H10.1 RN23.5 U60.1(IO1)
IN1P: C150.5 C150.6 C150.7 C150.8 C151.1 C151.2 C151.3 C151.4 H7.1 R15.1 R19.1 R33.1 R36.1 R41.1 R52.1 R54.1 R56.1 R58.2 RN16.1 RN16.2 RN16.3 RN16.4 RN17.1 RN17.2 RN17.3 RN17.4 U1.2(IN8P) U1.4(IN7P) U1.6(IN6P) U1.8(IN5P) U1.10(IN4P) U1.12(IN3P) U1.14(IN2P) U1.16(IN1P) U1.17(SRB1) U16.1(IO1) U32.17(SRB1) U48.17(SRB1) U53.17(SRB1)
IN9P: C152.8 RN18.1 U32.16(IN1P)
IN10P: C152.7 RN18.2 U32.14(IN2P)
IN11P: C152.6 RN18.3 U32.12(IN3P)
IN12P: C152.5 RN18.4 U32.10(IN4P)
IN13P: C153.4 RN19.1 U32.8(IN5P)
IN14P: C153.3 RN19.2 U32.6(IN6P)
IN15P: C153.2 RN19.3 U32.4(IN7P)
IN16P: C153.1 RN19.4 U32.2(IN8P)
IN17P: C154.8 RN20.1 U48.16(IN1P)
IN18P: C154.7 RN20.2 U48.14(IN2P)
IN19P: C154.6 RN20.3 U48.12(IN3P)
IN20P: C154.5 RN20.4 U48.10(IN4P)
IN21P: C155.4 RN21.1 U48.8(IN5P)
IN22P: C155.3 RN21.2 U48.6(IN6P)
IN23P: C155.2 RN21.3 U48.4(IN7P)
IN24P: C155.1 RN21.4 U48.2(IN8P)
IN25P: C156.8 RN22.1 U53.16(IN1P)
IN26P: C156.7 RN22.2 U53.14(IN2P)
IN27P: C156.6 RN22.3 U53.12(IN3P)
IN28P: C156.5 RN22.4 U53.10(IN4P)
IN29P: C157.4 RN23.1 U53.8(IN5P)
IN30P: C157.3 RN23.2 U53.6(IN6P)
IN31P: C157.2 RN23.3 U53.4(IN7P)
IN32P: C157.1 RN23.4 U53.2(IN8P)
MISO: H12.3 U1.43(DOUT)
MOSI: H12.4 U1.34(DIN) U32.34(DIN) U48.34(DIN) U53.34(DIN)
RESET: H13.2 U1.36(RESET#) U32.36(RESET#) U48.36(RESET#) U53.36(RESET#)
RL: H7.10 R2.2 U11.5(IO4)
SCLK: H12.2 U1.40(SCLK) U32.40(SCLK) U48.40(SCLK) U53.40(SCLK)
START: H13.3 U1.38(START) U32.38(START) U48.38(START) U53.38(START)
$1N3003: C38.2 C39.2 U1.24(VREFP)
$1N3116: C40.2 U1.26(VCAP4)
$1N3286: C86.2 U1.28(VCAP1)
$1N3353: C43.2 U1.30(VCAP2)
$1N5373: C45.2 C46.1 U1.55(VCAP3)
$1N33196: C13.1 U22.4(NR/FB)
$1N37296: C55.2 U21.3(CFLY-)
$1N37302: C55.1 U21.5(CFLY+)
$1N55627: R19.2 U1.1(IN8N) U1.3(IN7N) U1.5(IN6N) U1.7(IN5N) U1.9(IN4N) U1.11(IN3N) U1.13(IN2N) U1.15(IN1N)
$1N55886: R48.2 U1.37(CLK)
$1N55909: C150.1 C150.2 C150.3 C150.4 C151.5 C151.6 C151.7 C151.8 R15.2
$3N17: C77.2 C78.2 U32.24(VREFP)
$3N19: C79.2 U32.26(VCAP4)
$3N21: C87.2 U32.28(VCAP1)
$3N22: C81.2 U32.30(VCAP2)
$3N37: C82.2 C83.1 U32.55(VCAP3)
$3N174: R36.2 U32.1(IN8N) U32.3(IN7N) U32.5(IN6N) U32.7(IN5N) U32.9(IN4N) U32.11(IN3N) U32.13(IN2N) U32.15(IN1N)
$3N360: C152.1 C152.2 C152.3 C152.4 C153.5 C153.6 C153.7 C153.8 R33.2
$4N31: R41.2 U48.1(IN8N) U48.3(IN7N) U48.5(IN6N) U48.7(IN5N) U48.9(IN4N) U48.11(IN3N) U48.13(IN2N) U48.15(IN1N)
$4N82: C108.2 C109.1 U48.55(VCAP3)
$4N96: C107.2 U48.30(VCAP2)
$4N97: C112.2 U48.28(VCAP1)
$4N99: C106.2 U48.26(VCAP4)
$4N101: C104.2 C105.2 U48.24(VREFP)
$4N153: C154.1 C154.2 C154.3 C154.4 C155.5 C155.6 C155.7 C155.8 R54.2
$5N129: C121.2 C122.2 U53.24(VREFP)
$5N131: C123.2 U53.26(VCAP4)
$5N133: C129.2 U53.28(VCAP1)
$5N134: C124.2 U53.30(VCAP2)
$5N148: C125.2 C126.1 U53.55(VCAP3)
$5N199: R52.2 U53.1(IN8N) U53.3(IN7N) U53.5(IN6N) U53.7(IN5N) U53.9(IN4N) U53.11(IN3N) U53.13(IN2N) U53.15(IN1N)
$5N268: C156.1 C156.2 C156.3 C156.4 C157.5 C157.6 C157.7 C157.8 R56.2

Not connected (* = marked no-connect by the designer): H12 1*; H13 6* 7*; U1 18(SRB2)* 27(NC)* 29(NC)* 42(GPIO1)* 44(GPIO2)* 45(GPIO3)* 46(GPIO4)* 64(RESERVED)*; U3 4(NC)*; U11 6(NC)*; U16 6(NC)*; U17 4(IO3)* 5(IO4)* 6(NC)*; U32 18(SRB2)* 27(NC)* 29(NC)* 42(GPIO1)* 44(GPIO2)* 45(GPIO3)* 46(GPIO4)* 47(DRDY#)* 62(BIASIN)* 63(BIASOUT)* 64(RESERVED)*; U37 6(NC)*; U39 6(NC)*; U48 18(SRB2)* 27(NC)* 29(NC)* 42(GPIO1)* 44(GPIO2)* 45(GPIO3)* 46(GPIO4)* 47(DRDY#)* 62(BIASIN)* 63(BIASOUT)* 64(RESERVED)*; U53 18(SRB2)* 27(NC)* 29(NC)* 42(GPIO1)* 44(GPIO2)* 45(GPIO3)* 46(GPIO4)* 47(DRDY#)* 62(BIASIN)* 63(BIASOUT)* 64(RESERVED)*; U58 6(NC)*; U59 6(NC)*; U60 6(NC)*; U61 6(NC)*

## Notes on the sheets
sheet 1
- 电源稳压
- 3.3V
- +2.5V REGULATOR
- -2.5 REGULATOR
- 低通滤波
- ESD防护
sheet 2
- ESD防护
sheet 3
- ESD防护
sheet 4
- ESD防护
